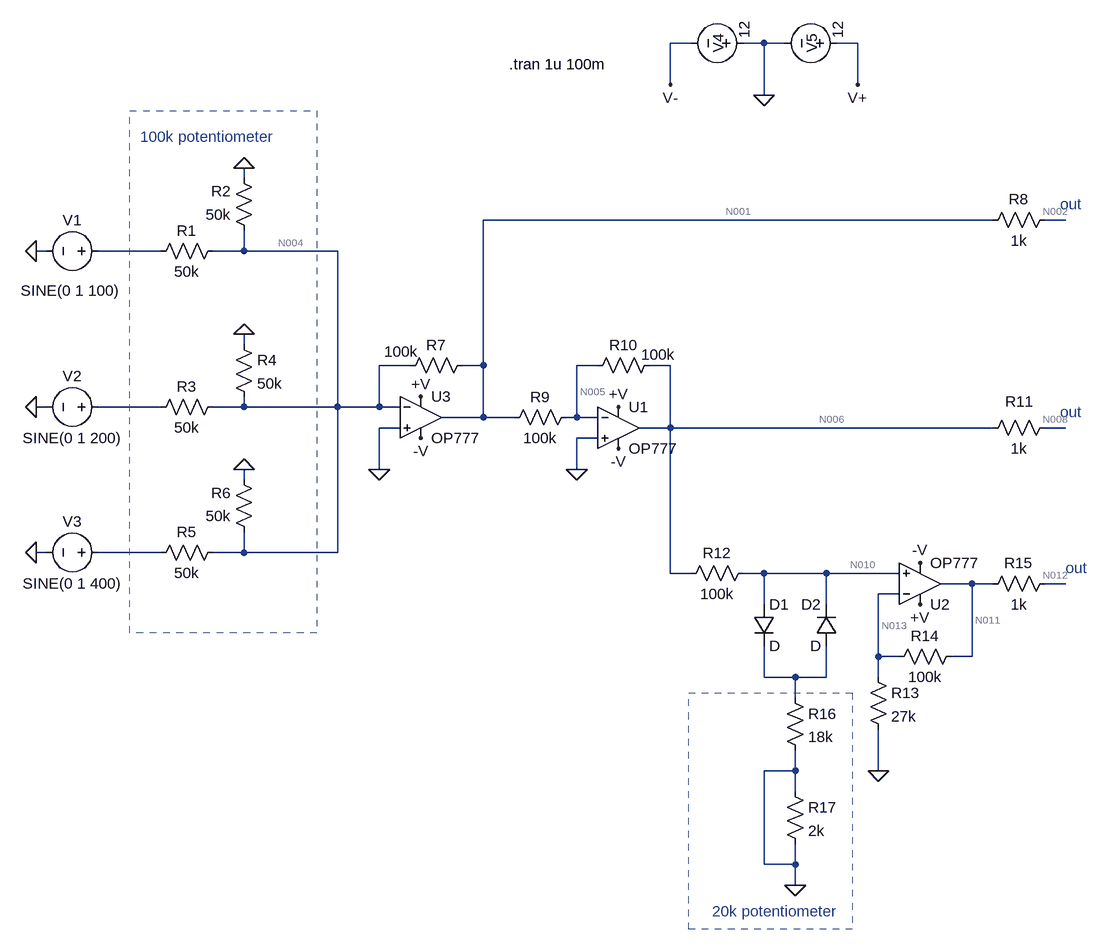
[diagram p0: schematic mixer-simulation.asc]
mixer-simulation.asc, the LTspice schematic file:
Version 4
SHEET 1 1528 1064
WIRE 912 -320 880 -320
WIRE 1024 -320 992 -320
WIRE 1056 -320 1024 -320
WIRE 1168 -320 1136 -320
WIRE 880 -256 880 -320
WIRE 1168 -256 1168 -320
WIRE 1024 -240 1024 -320
WIRE 224 -112 224 -128
WIRE 1376 -48 592 -48
WIRE 1488 -48 1456 -48
WIRE -80 0 -96 0
WIRE 96 0 0 0
WIRE 224 0 224 -32
WIRE 224 0 176 0
WIRE 368 0 224 0
WIRE 224 144 224 128
WIRE 480 176 432 176
WIRE 592 176 592 -48
WIRE 592 176 560 176
WIRE 768 176 736 176
WIRE 880 176 848 176
WIRE -80 240 -96 240
WIRE 96 240 0 240
WIRE 224 240 224 224
WIRE 224 240 176 240
WIRE 368 240 368 0
WIRE 368 240 224 240
WIRE 432 240 432 176
WIRE 432 240 368 240
WIRE 464 240 432 240
WIRE 592 256 592 176
WIRE 592 256 528 256
WIRE 640 256 592 256
WIRE 736 256 736 176
WIRE 736 256 720 256
WIRE 768 256 736 256
WIRE 464 272 432 272
WIRE 880 272 880 176
WIRE 880 272 832 272
WIRE 1376 272 880 272
WIRE 1488 272 1456 272
WIRE 768 288 736 288
WIRE 432 336 432 272
WIRE 736 336 736 288
WIRE 224 352 224 336
WIRE -80 464 -96 464
WIRE 96 464 0 464
WIRE 224 464 224 432
WIRE 224 464 176 464
WIRE 368 464 368 240
WIRE 368 464 224 464
WIRE 880 496 880 272
WIRE 912 496 880 496
WIRE 1024 496 992 496
WIRE 1120 496 1024 496
WIRE 1232 496 1120 496
WIRE 1344 512 1296 512
WIRE 1376 512 1344 512
WIRE 1488 512 1456 512
WIRE 1232 528 1200 528
WIRE 1024 544 1024 496
WIRE 1120 544 1120 496
WIRE 1200 624 1200 528
WIRE 1232 624 1200 624
WIRE 1344 624 1344 512
WIRE 1344 624 1312 624
WIRE 1024 656 1024 608
WIRE 1072 656 1024 656
WIRE 1120 656 1120 608
WIRE 1120 656 1072 656
WIRE 1200 656 1200 624
WIRE 1072 688 1072 656
WIRE 1072 800 1072 768
WIRE 1072 800 1024 800
WIRE 1200 800 1200 736
WIRE 1072 832 1072 800
WIRE 1024 944 1024 800
WIRE 1072 944 1072 912
WIRE 1072 944 1024 944
WIRE 1072 976 1072 944
FLAG 224 -128 0
FLAG 224 128 0
FLAG 224 336 0
FLAG 432 336 0
FLAG 736 336 0
FLAG 1200 800 0
FLAG 1072 976 0
FLAG -96 0 0
FLAG -96 240 0
FLAG -96 464 0
FLAG 1024 -240 0
FLAG 1168 -256 V+
FLAG 880 -256 V-
FLAG 800 240 +V
FLAG 800 304 -V
FLAG 496 224 +V
FLAG 496 288 -V
FLAG 1264 544 +V
FLAG 1264 480 -V
SYMBOL Voltage 16 0 R90
WINDOW 0 -32 56 VBottom 2
WINDOW 3 45 59 VTop 2
SYMATTR InstName V1
SYMATTR Value SINE(0 1 100)
SYMBOL Voltage 16 240 R90
WINDOW 0 -32 56 VBottom 2
WINDOW 3 32 56 VTop 2
SYMATTR InstName V2
SYMATTR Value SINE(0 1 200)
SYMBOL Voltage 16 464 R90
WINDOW 0 -32 56 VBottom 2
WINDOW 3 32 56 VTop 2
SYMATTR InstName V3
SYMATTR Value SINE(0 1 400)
SYMBOL Res 192 -16 R90
WINDOW 0 0 56 VBottom 2
WINDOW 3 32 56 VTop 2
SYMATTR InstName R1
SYMATTR Value 50k
SYMBOL Res 240 -16 R180
WINDOW 0 36 76 Left 2
WINDOW 3 36 40 Left 2
SYMATTR InstName R2
SYMATTR Value 50k
SYMBOL Res 80 256 R270
WINDOW 0 32 56 VTop 2
WINDOW 3 0 56 VBottom 2
SYMATTR InstName R3
SYMATTR Value 50k
SYMBOL Res 208 128 R0
SYMATTR InstName R4
SYMATTR Value 50k
SYMBOL Res 192 448 R90
WINDOW 0 0 56 VBottom 2
WINDOW 3 32 56 VTop 2
SYMATTR InstName R5
SYMATTR Value 50k
SYMBOL Res 240 448 R180
WINDOW 0 36 76 Left 2
WINDOW 3 36 40 Left 2
SYMATTR InstName R6
SYMATTR Value 50k
SYMBOL Res 576 160 R90
WINDOW 0 0 56 VBottom 2
WINDOW 3 -21 110 VTop 2
SYMATTR InstName R7
SYMATTR Value 100k
SYMBOL Res 1472 -64 R90
WINDOW 0 0 56 VBottom 2
WINDOW 3 32 56 VTop 2
SYMATTR InstName R8
SYMATTR Value 1k
SYMBOL Res 736 240 R90
WINDOW 0 0 56 VBottom 2
WINDOW 3 32 56 VTop 2
SYMATTR InstName R9
SYMATTR Value 100k
SYMBOL Res 864 160 R90
WINDOW 0 0 56 VBottom 2
WINDOW 3 -16 3 VTop 2
SYMATTR InstName R10
SYMATTR Value 100k
SYMBOL Res 1472 256 R90
WINDOW 0 -9 55 VBottom 2
WINDOW 3 32 56 VTop 2
SYMATTR InstName R11
SYMATTR Value 1k
SYMBOL Res 1008 480 R90
WINDOW 0 0 56 VBottom 2
WINDOW 3 32 56 VTop 2
SYMATTR InstName R12
SYMATTR Value 100k
SYMBOL Diode 1008 544 R0
SYMATTR InstName D1
SYMBOL Diode 1136 608 R180
WINDOW 0 24 64 Left 2
WINDOW 3 24 0 Left 2
SYMATTR InstName D2
SYMBOL Res 1184 640 R0
SYMATTR InstName R13
SYMATTR Value 27k
SYMBOL Res 1328 608 R90
WINDOW 0 0 56 VBottom 2
WINDOW 3 32 56 VTop 2
SYMATTR InstName R14
SYMATTR Value 100k
SYMBOL Res 1472 496 R90
WINDOW 0 0 56 VBottom 2
WINDOW 3 32 56 VTop 2
SYMATTR InstName R15
SYMATTR Value 1k
SYMBOL Res 1056 672 R0
SYMATTR InstName R16
SYMATTR Value 18k
SYMBOL Res 1056 816 R0
SYMATTR InstName R17
SYMATTR Value 2k
SYMBOL OpAmps/OP777 800 208 R0
SYMATTR InstName U1
SYMBOL voltage 1008 -320 M270
WINDOW 0 0 70 Bottom 2
WINDOW 3 21 -1 Top 2
WINDOW 123 0 0 Left 2
WINDOW 39 -60 56 VBottom 2
SYMATTR InstName V4
SYMATTR Value 12
SYMBOL voltage 1152 -320 M270
WINDOW 0 0 70 Bottom 2
WINDOW 3 21 -1 Top 2
WINDOW 123 0 0 Left 2
WINDOW 39 -60 56 VBottom 2
SYMATTR InstName V5
SYMATTR Value 12
SYMBOL OpAmps/OP777 496 192 R0
SYMATTR InstName U3
SYMBOL OpAmps/OP777 1264 576 M180
SYMATTR InstName U2
TEXT 64 -176 Left 2 ;100k potentiometer
TEXT 1480 -72 Left 2 ;out
TEXT 944 1016 Left 2 ;20k potentiometer
TEXT 632 -288 Left 2 !.tran 1u 100m
TEXT 1480 248 Left 2 ;out
TEXT 1488 488 Left 2 ;out
RECTANGLE Normal 908 680 1160 1044 2
RECTANGLE Normal 48 -216 336 588 2

The netlist it stands for:
* mixer-simulation.asc
V1 N003 0 SINE(0 1 100)
V2 N007 0 SINE(0 1 200)
V3 N009 0 SINE(0 1 400)
R1 N004 N003 50k
R2 N004 0 50k
R3 N007 N004 50k
R4 0 N004 50k
R5 N004 N009 50k
R6 N004 0 50k
R7 N001 N004 100k
R8 N002 N001 1k
R9 N005 N001 100k
R10 N006 N005 100k
R11 N008 N006 1k
R12 N010 N006 100k
D1 N010 N014 D
D2 N014 N010 D
R13 N013 0 27k
R14 N011 N013 100k
R15 N012 N011 1k
R16 N014 0 18k
R17 0 0 2k
XU1 0 N005 +V -V N006 OP777  ; pins In+ In- V+ V- OUT
V4 0 V- 12
V5 V+ 0 12
XU3 0 N004 +V -V N001 OP777  ; pins In+ In- V+ V- OUT
XU2 N010 N013 +V -V N011 OP777  ; pins In+ In- V+ V- OUT
.model D D
.lib standard.dio
* 100k potentiometer
* out
* 20k potentiometer
.tran 1u 100m
* out
* out
.lib ADI.lib
.backanno
.end

* Results of the author's LTspice run, read from the files saved beside the schematic
* Operating Point, zero values left out:
*   V(n004) = -8.996 µV
*   V(n001) = -16.91 µV
*   V(n002) = -16.91 µV
*   V(n005) = -66.72 µV
*   V(n006) = -16.49 µV
*   V(n008) = -16.49 µV
*   V(n010) = 83.47 µV
*   V(n013) = -24.83 µV
*   V(n011) = -16.75 µV
*   V(n012) = -16.75 µV
*   V(-v) = -16.72 µV
*   V(+v) = -16.72 µV
*   V(v-) = -12 V
*   V(v+) = 12 V
*   I(R1) = -179.9 pA
*   I(R2) = -179.9 pA
*   I(R3) = 179.9 pA
*   I(R4) = 179.9 pA
*   I(R5) = -179.9 pA
*   I(R6) = -179.9 pA
*   I(R7) = -79.09 pA
*   I(R9) = -498.1 pA
*   I(R10) = 502.3 pA
*   I(R12) = 999.6 pA
*   I(R13) = -919.6 pA
*   I(R14) = 80.78 pA
*   I(V1) = -179.9 pA
*   I(V2) = -179.9 pA
*   I(V3) = -179.9 pA
*   Ix(u1:1) = -999.6 pA
*   Ix(u1:2) = 1 nA
*   Ix(u1:99) = -223.6 pA
*   Ix(u1:50) = -274.6 pA
*   Ix(u1:45) = 497.3 pA
*   Ix(u3:1) = -999.6 pA
*   Ix(u3:2) = 1 nA
*   Ix(u3:99) = 187.7 pA
*   Ix(u3:50) = 230.5 pA
*   Ix(u3:45) = -419 pA
*   Ix(u2:1) = -999.6 pA
*   Ix(u2:2) = 1 nA
*   Ix(u2:99) = 35.88 pA
*   Ix(u2:50) = 44.06 pA
*   Ix(u2:45) = -80.78 pA
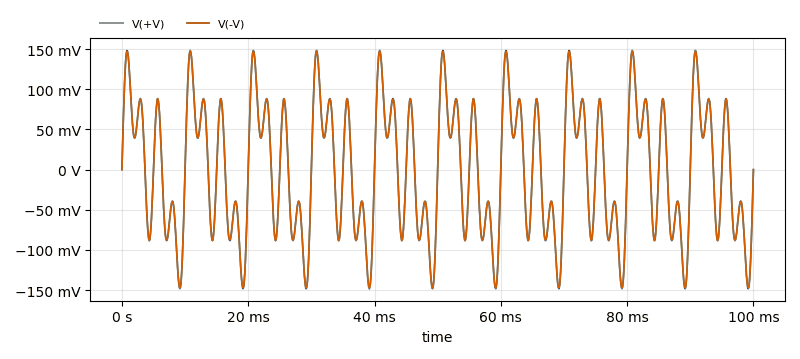
[diagram p1: Transient Analysis of mixer-simulation.asc, plotted from the saved traces]
* Transient Analysis, 1 run:
*   V(+V): min -148.4 mV, max 148.4 mV, average -12.26 µV, rms 81.47 mV, last -16.8 µV
*   V(-V): min -147.4 mV, max 147.3 mV, average -11.97 µV, rms 81.08 mV, last -16.8 µV